# EAGLE design AD2 (EAGLE 8.2.2)
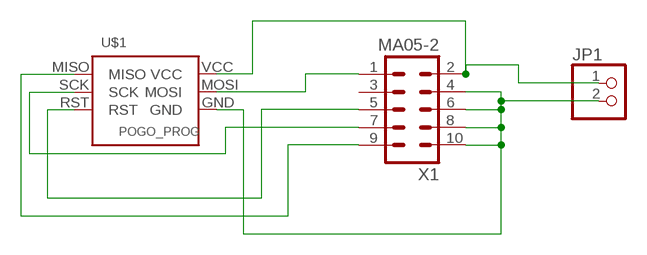
[diagram p0: schematic, sheet 1]

## Parts
JP1  PINHD-1X2/90  [1X02/90]
U$1  POGO_PROG  [POGO_PROG]
X1  MA05-2  [MA05-2]

## Nets
N$1: U$1.MOSI X1.1
N$2: U$1.RST X1.5
N$3: U$1.SCK X1.7
N$4: U$1.MISO X1.9
N$5: JP1.1 U$1.VCC X1.2
N$6: JP1.2 U$1.GND X1.4 X1.6 X1.8 X1.10
Unconnected: X1.3

## Library data of the parts
JP1 = pinhead:PINHD-1X2: PIN HEADER
U$1 = usb:POGO_PROG
X1 = usb:MA05-2: PIN HEADER; OC_FARNELL: unknown; OC_NEWARK: unknown

## Board
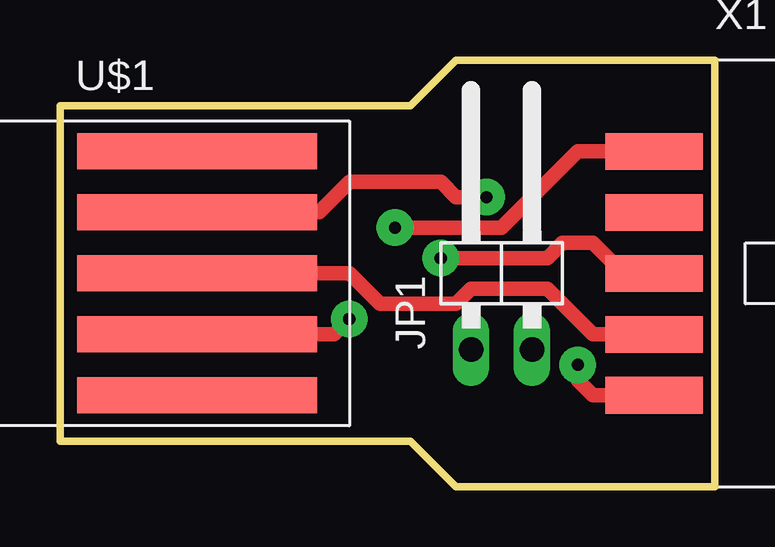
[diagram p1: board, top side]
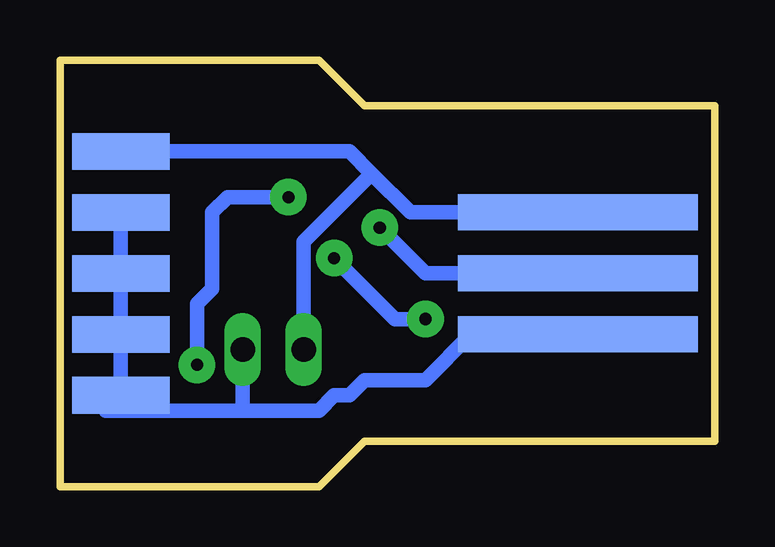
[diagram p2: board, bottom side, seen from below]

Size 27.3 x 17.78 mm. Coordinates in mm from the lower left corner, seen from the top.
Outline: 0,15.88 14.61,15.88 16.51,17.78 27.3,17.78 27.3,0 16.51,0 14.61,1.91 0,1.91 0,15.88
Copper layers (1*16): Top 0.035mm / dielectric 1.5mm / Bottom 0.035mm
Design rules "default": minimum track width 6mil, minimum drill 0.35mm, track to track 6mil, track to pad 6mil, pad to pad 6mil, via to via 6mil, smd to smd 6mil, copper to edge 40mil, drill to drill 6mil, minimum pad ring 10mil, minimum via ring 8mil, stop-mask expansion 4mil, vias tented up to drill 0mil, thermal gap 10mil

### Footprints (pad centres in the part's own frame; a part is rotated, then mirrored left to right if it is on the bottom)
1X02/90 = drill 1.016 long: 1 -1.27,-3.81; 2 1.27,-3.81
POGO_PROG = smd 10 x 1.5 bottom: GND 3.81,10.16; MOSI 3.81,12.7; VCC 3.81,15.24 | smd 10 x 1.5: MISO 3.81,15.24; P$7 3.81,17.78; P$8 3.81,7.62; RST 3.81,10.16; SCK 3.81,12.7
MA05-2 = smd 4.064 x 1.524: 1 0,5.08; 3 0,2.54; 5 0,0; 7 0,-2.54; 9 0,-5.08 | smd 4.064 x 1.524 bottom: 2 0,5.08; 4 0,2.54; 6 0,0; 8 0,-2.54; 10 0,-5.08

### Placement (x,y rotation side)
JP1  18.41,9.53 0 top
U$1  1.91,-3.81 0 top
X1  24.77,8.89 0 top

### Tracks (layer width: path | path; a pad name or v marks a point on that pad's centre or on a via)
N$1  (via drill 0.51 pad 1.52)
  Top 0.61: v13.97,10.79 18.41,10.79 21.59,13.97 X1.1
  Bottom 0.61: v13.97,10.79 12.06,8.89 U$1.MOSI
N$2  (via drill 0.51 pad 1.52)
  Top 0.61: X1.5 23.5,8.89 22.23,10.16 20.95,10.16 20.32,9.53 v15.88,9.53 | U$1.RST 11.43,6.35 v12.06,6.99
  Bottom 0.61: v12.06,6.99 13.34,6.99 v15.88,9.53
N$3
  Top 0.61: X1.7 22.23,6.35 20.32,8.25 17.14,8.25 16.51,7.62 13.34,7.62 12.06,8.89 U$1.SCK
N$4  (via drill 0.51 pad 1.52)
  Top 0.61: 23.5,3.81 X1.9 22.23,3.81 21.59,4.45 v21.59,5.08 | v17.78,12.06 16.51,12.06 15.88,12.7 12.06,12.7 10.79,11.43 U$1.MISO
  Bottom 0.61: v21.59,5.08 21.59,7.62 20.95,8.25 20.95,11.43 20.32,12.06 v17.78,12.06
N$5
  Bottom 0.61: X1.2 15.24,13.97 14.32,13.05 | 14.32,13.05 12.7,11.43 U$1.VCC | JP1.1 17.14,10.22 14.32,13.05
N$6
  Bottom 0.61: X1.4 X1.6 X1.8 X1.10 25.4,3.17 19.8,3.17 | U$1.GND 10.16,6.35 12.06,4.45 14.61,4.45 15.24,3.81 15.88,3.81 16.51,3.17 19.8,3.17 | JP1.2 19.68,3.29 19.8,3.17